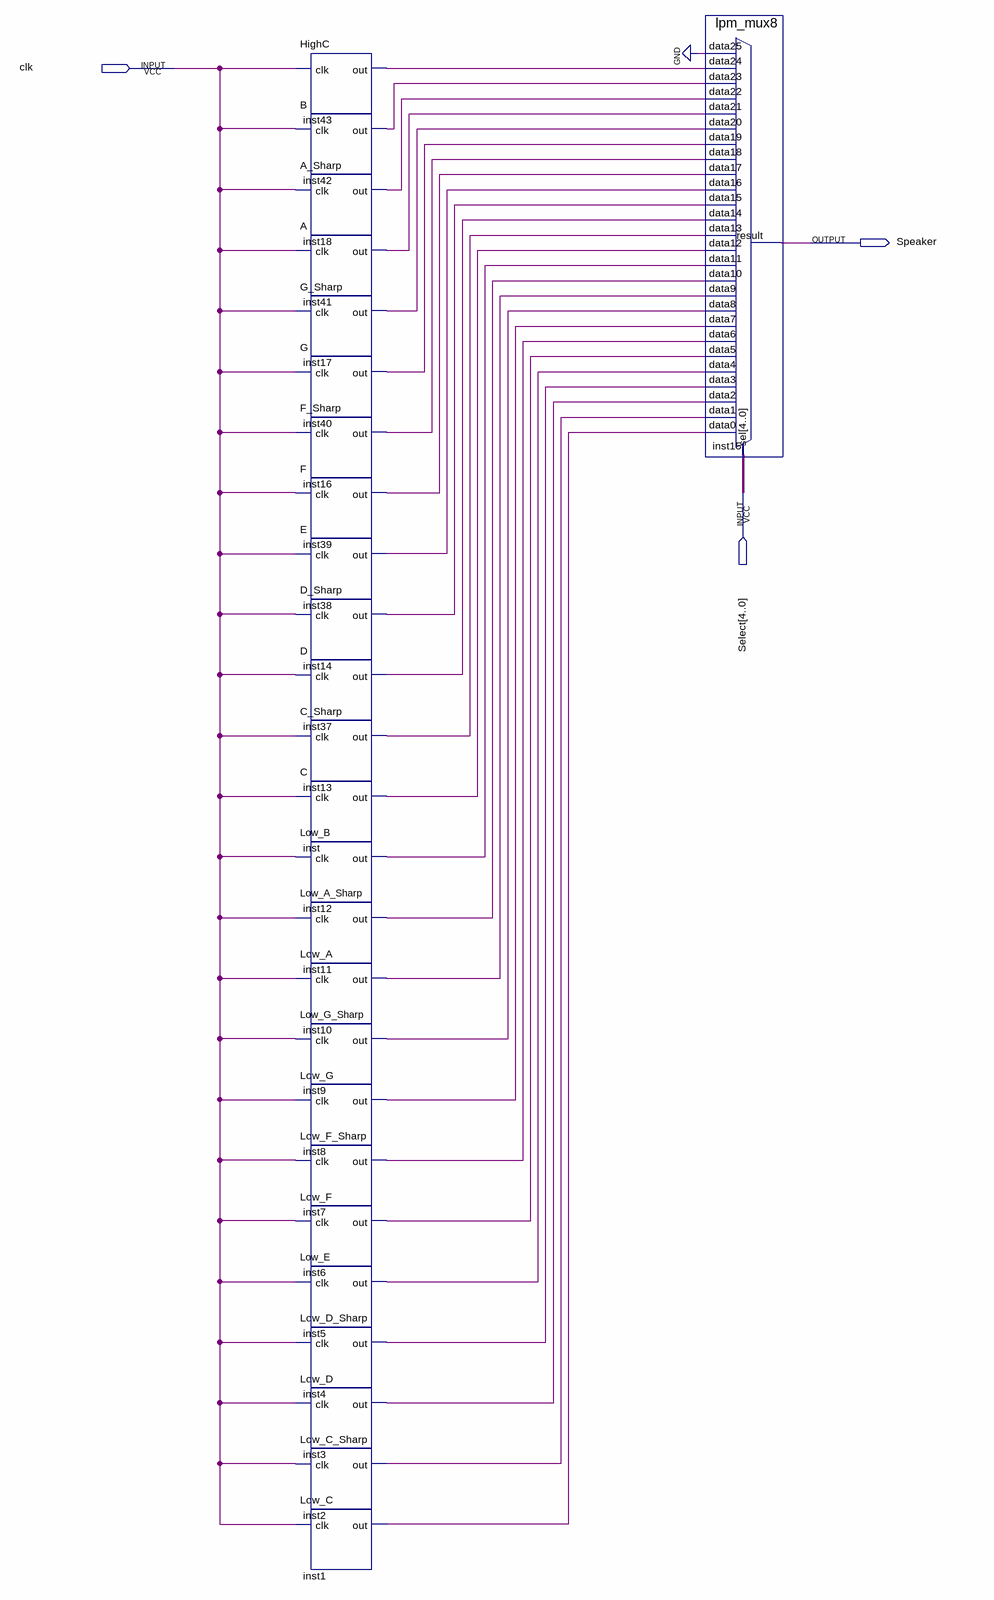
[diagram p0: schematic sheet]
// Quartus schematic M.bdf as structural Verilog: 26 symbols, 3 pins
module M (
  input  clk,
  input  [4:0] Select,
  output Speaker
);

  wire inst1_out, inst2_out, inst3_out, inst4_out, inst5_out, inst6_out, inst7_out, inst8_out, inst9_out,
       inst10_out, inst11_out, inst12_out, inst13_out, inst14_out, inst16_out, inst17_out, inst18_out,
       inst37_out, inst38_out, inst39_out, inst40_out, inst41_out, inst42_out, inst43_out, inst_out;

  HighC inst43 (.clk(clk), .out(inst43_out));
  B inst42 (.clk(clk), .out(inst42_out));
  A_Sharp inst18 (.clk(clk), .out(inst18_out));
  A inst41 (.clk(clk), .out(inst41_out));
  G_Sharp inst17 (.clk(clk), .out(inst17_out));
  G inst40 (.clk(clk), .out(inst40_out));
  F_Sharp inst16 (.clk(clk), .out(inst16_out));
  F inst39 (.clk(clk), .out(inst39_out));
  E inst38 (.clk(clk), .out(inst38_out));
  D_Sharp inst14 (.clk(clk), .out(inst14_out));
  D inst37 (.clk(clk), .out(inst37_out));
  C_Sharp inst13 (.clk(clk), .out(inst13_out));
  C inst (.clk(clk), .out(inst_out));
  Low_B inst12 (.clk(clk), .out(inst12_out));
  Low_A_Sharp inst11 (.clk(clk), .out(inst11_out));
  Low_A inst10 (.clk(clk), .out(inst10_out));
  Low_G_Sharp inst9 (.clk(clk), .out(inst9_out));
  Low_G inst8 (.clk(clk), .out(inst8_out));
  Low_F_Sharp inst7 (.clk(clk), .out(inst7_out));
  Low_F inst6 (.clk(clk), .out(inst6_out));
  Low_E inst5 (.clk(clk), .out(inst5_out));
  Low_D_Sharp inst4 (.clk(clk), .out(inst4_out));
  Low_D inst3 (.clk(clk), .out(inst3_out));
  Low_C_Sharp inst2 (.clk(clk), .out(inst2_out));
  Low_C inst1 (.clk(clk), .out(inst1_out));
  lpm_mux8 inst15 (
    .data25(1'b0), .data24(inst43_out), .data23(inst42_out), .data22(inst18_out), .data21(inst41_out),
    .data20(inst17_out), .data19(inst40_out), .data18(inst16_out), .data17(inst39_out), .data16(inst38_out),
    .data15(inst14_out), .data14(inst37_out), .data13(inst13_out), .data12(inst_out), .data11(inst12_out),
    .data10(inst11_out), .data9(inst10_out), .data8(inst9_out), .data7(inst8_out), .data6(inst7_out),
    .data5(inst6_out), .data4(inst5_out), .data3(inst4_out), .data2(inst3_out), .data1(inst2_out),
    .data0(inst1_out), .sel(Select), .result(Speaker));
endmodule
